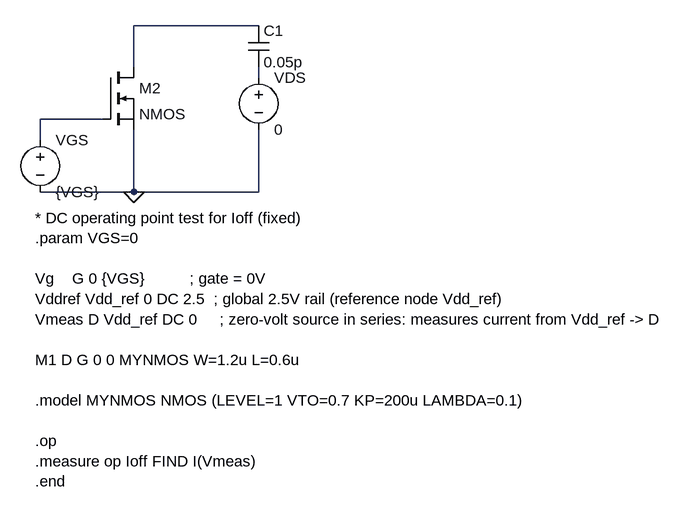
[diagram p0: schematic B.asc]
B.asc, the LTspice schematic file:
Version 4.1
SHEET 1 1100 792
WIRE 400 32 208 32
WIRE 208 96 208 32
WIRE 400 112 400 96
WIRE 160 176 64 176
WIRE 64 208 64 176
WIRE 208 288 208 192
WIRE 208 288 64 288
WIRE 400 288 400 192
WIRE 400 288 208 288
FLAG 208 288 0
SYMBOL nmos 160 96 R0
SYMATTR InstName M2
SYMBOL voltage 400 96 R0
SYMATTR InstName VDS
SYMATTR Value 0
SYMBOL voltage 64 192 R0
SYMATTR InstName VGS
SYMATTR Value {VGS}
SYMBOL cap 384 32 R0
SYMATTR InstName C1
SYMATTR Value 0.05p
TEXT 56 328 Left 2 !* DC operating point test for Ioff (fixed)\n.param VGS=0\n \nVg    G 0 {VGS}          ; gate = 0V\nVddref Vdd_ref 0 DC 2.5  ; global 2.5V rail (reference node Vdd_ref)\nVmeas D Vdd_ref DC 0     ; zero-volt source in series: measures current from Vdd_ref -> D\n \nM1 D G 0 0 MYNMOS W=1.2u L=0.6u\n \n.model MYNMOS NMOS (LEVEL=1 VTO=0.7 KP=200u LAMBDA=0.1)\n \n.op\n.measure op Ioff FIND I(Vmeas)\n.end

The netlist it stands for:
* B.asc
M2 N001 N003 0 0 NMOS
VDS N002 0 0
VGS N003 0 {VGS}
C1 N001 N002 0.05p
.model NMOS NMOS
.model PMOS PMOS
.lib standard.mos
* DC operating point test for Ioff (fixed)
.param VGS=0
Vg    G 0 {VGS}          ; gate = 0V
Vddref Vdd_ref 0 DC 2.5  ; global 2.5V rail (reference node Vdd_ref)
Vmeas D Vdd_ref DC 0     ; zero-volt source in series: measures current from Vdd_ref -> D
M1 D G 0 0 MYNMOS W=1.2u L=0.6u
.model MYNMOS NMOS (LEVEL=1 VTO=0.7 KP=200u LAMBDA=0.1)
.op
.measure op Ioff FIND I(Vmeas)
.end
.backanno
.end